# Altium schematic sheet [13] FPGA_PWR.SchDoc: FPGA Power
size 393 x 281 mm; SheetNumber: 13; SheetTotal: 21; PageSetup: Record=PageOptions|CenterHorizontal=True|CenterVertical=True|PrintScale=0.94|XCorrection=0.00|YCorrection=0.00|PrintKind=0|BorderSize=5000000|LeftOffset=0|BottomOffset=0|Orientation=2|PaperLength=1000|PaperWidth=1000|Scale=100|PaperSource=15|PrintQuality=600|MediaType=1|DitherType=10|PrintScaleMode=1|PaperKind=A4; Adr1: August Barks gata 6B; Adr2: SE-421 32 Västra Frölunda; Adr3: Sweden; Webpage: www.omnisys.se
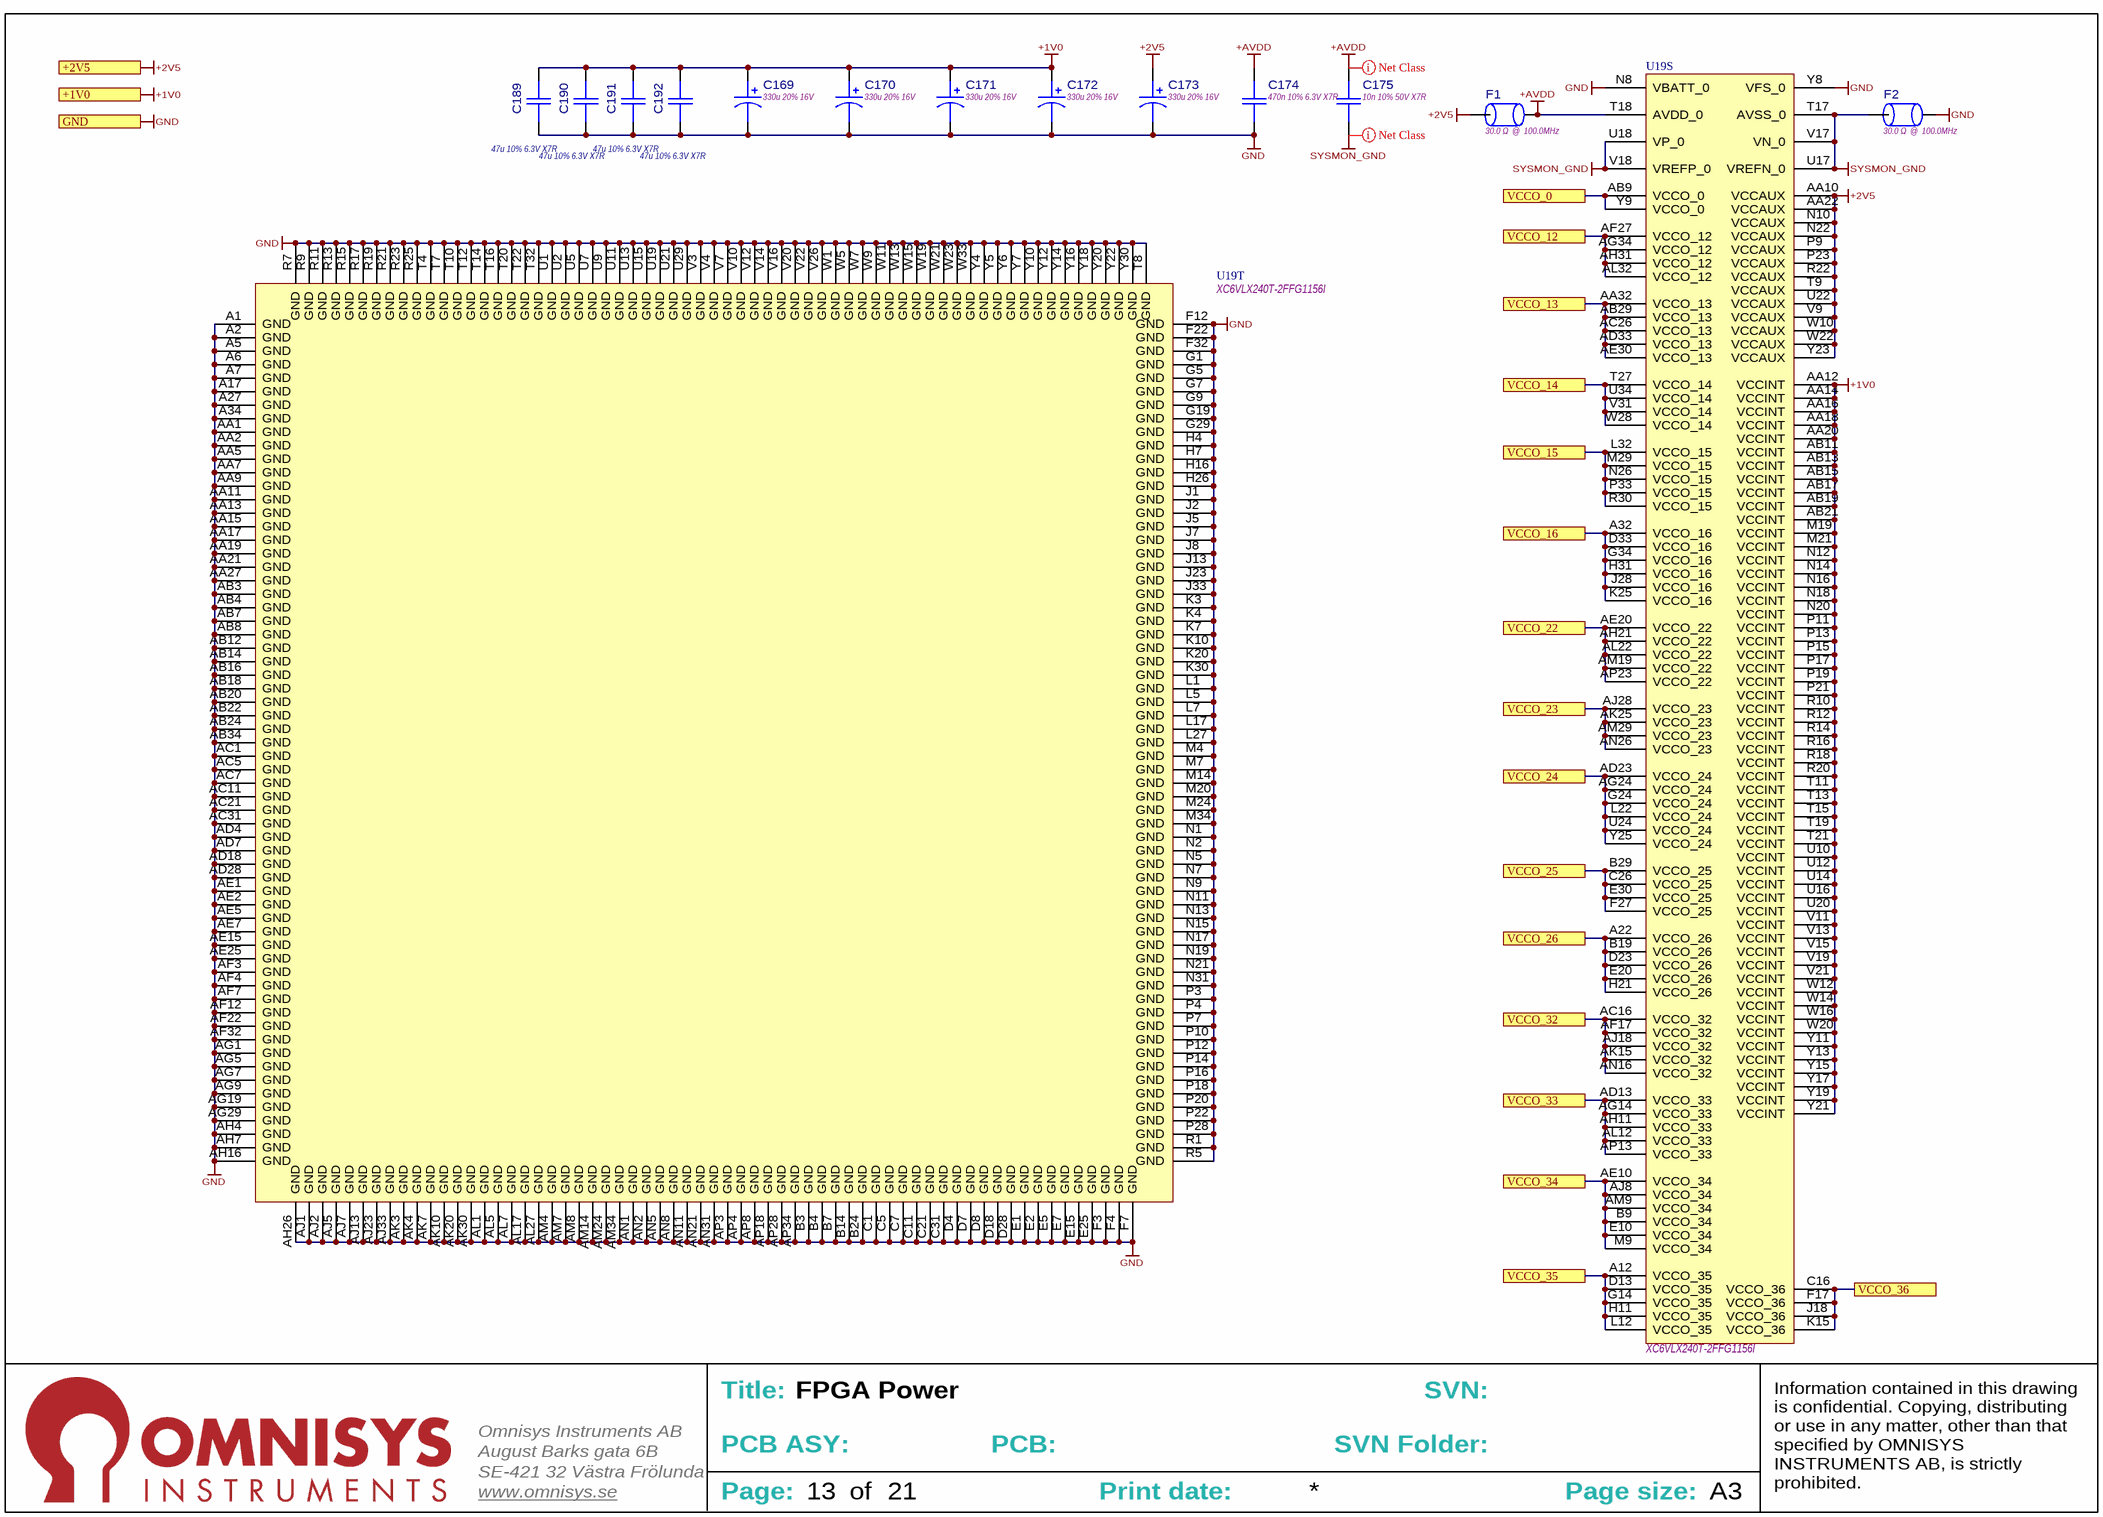
[diagram p0: [13] FPGA_PWR.SchDoc]

## Parts
C169  330u 20% 16V  [CAPMP7343X43N]
C170  330u 20% 16V  [CAPMP7343X43N]
C171  330u 20% 16V  [CAPMP7343X43N]
C172  330u 20% 16V  [CAPMP7343X43N]
C173  330u 20% 16V  [CAPMP7343X43N]
C174  470n 10% 6.3V X7R  [CAPC1608X90N]
C175  10n 10% 50V X7R  [CAPC1608X90N]
C189  47u 10% 6.3V X7R  [CAPC3225X270N]
C190  47u 10% 6.3V X7R  [CAPC3225X270N]
C191  47u 10% 6.3V X7R  [CAPC3225X270N]
C192  47u 10% 6.3V X7R  [CAPC3225X270N]
F1  30.0 Ω  @  100.0MHz  [INDC2012X11L]
F2  30.0 Ω  @  100.0MHz  [INDC2012X11L]
U19  XC6VLX240T-2FFG1156I  [FFG1156]  (parts S,T of 20)

## Ports
+1V0, +2V5, GND, VCCO_0, VCCO_12, VCCO_13, VCCO_14, VCCO_15, VCCO_16, VCCO_22, VCCO_23, VCCO_24, VCCO_25, VCCO_26, VCCO_32, VCCO_33, VCCO_34, VCCO_35, VCCO_36

## Nets
+1V0: C169.1 C170.1 C171.1 C172.1 C189.1 C190.1 C191.1 C192.1 U19.AA12(VCCINT) U19.AA14(VCCINT) U19.AA16(VCCINT) U19.AA18(VCCINT) U19.AA20(VCCINT) U19.AB11(VCCINT) U19.AB13(VCCINT) U19.AB15(VCCINT) U19.AB17(VCCINT) U19.AB19(VCCINT) U19.AB21(VCCINT) U19.M19(VCCINT) U19.M21(VCCINT) U19.N12(VCCINT) U19.N14(VCCINT) U19.N16(VCCINT) U19.N18(VCCINT) U19.N20(VCCINT) U19.P11(VCCINT) U19.P13(VCCINT) U19.P15(VCCINT) U19.P17(VCCINT) U19.P19(VCCINT) U19.P21(VCCINT) U19.R10(VCCINT) U19.R12(VCCINT) U19.R14(VCCINT) U19.R16(VCCINT) U19.R18(VCCINT) U19.R20(VCCINT) U19.T11(VCCINT) U19.T13(VCCINT) U19.T15(VCCINT) U19.T19(VCCINT) U19.T21(VCCINT) U19.U10(VCCINT) U19.U12(VCCINT) U19.U14(VCCINT) U19.U16(VCCINT) U19.U20(VCCINT) U19.V11(VCCINT) U19.V13(VCCINT) U19.V15(VCCINT) U19.V19(VCCINT) U19.V21(VCCINT) U19.W12(VCCINT) U19.W14(VCCINT) U19.W16(VCCINT) U19.W20(VCCINT) U19.Y11(VCCINT) U19.Y13(VCCINT) U19.Y15(VCCINT) U19.Y17(VCCINT) U19.Y19(VCCINT) U19.Y21(VCCINT) ; port +1V0
+2V5: C173.1 F1.1 U19.AA10(VCCAUX) U19.AA22(VCCAUX) U19.N10(VCCAUX) U19.N22(VCCAUX) U19.P9(VCCAUX) U19.P23(VCCAUX) U19.R22(VCCAUX) U19.T9(VCCAUX) U19.U22(VCCAUX) U19.V9(VCCAUX) U19.W10(VCCAUX) U19.W22(VCCAUX) U19.Y23(VCCAUX) ; port +2V5
+AVDD: C174.1 C175.1 F1.2 U19.T18(AVDD_0)
GND: C169.2 C170.2 C171.2 C172.2 C173.2 C174.2 C189.2 C190.2 C191.2 C192.2 F2.2 U19.A1(GND) U19.A2(GND) U19.A5(GND) U19.A6(GND) U19.A7(GND) U19.A17(GND) U19.A27(GND) U19.A34(GND) U19.AA1(GND) U19.AA2(GND) U19.AA5(GND) U19.AA7(GND) U19.AA9(GND) U19.AA11(GND) U19.AA13(GND) U19.AA15(GND) U19.AA17(GND) U19.AA19(GND) U19.AA21(GND) U19.AA27(GND) U19.AB3(GND) U19.AB4(GND) U19.AB7(GND) U19.AB8(GND) U19.AB12(GND) U19.AB14(GND) U19.AB16(GND) U19.AB18(GND) U19.AB20(GND) U19.AB22(GND) U19.AB24(GND) U19.AB34(GND) U19.AC1(GND) U19.AC5(GND) U19.AC7(GND) U19.AC11(GND) U19.AC21(GND) U19.AC31(GND) U19.AD4(GND) U19.AD7(GND) U19.AD18(GND) U19.AD28(GND) U19.AE1(GND) U19.AE2(GND) U19.AE5(GND) U19.AE7(GND) U19.AE15(GND) U19.AE25(GND) U19.AF3(GND) U19.AF4(GND) U19.AF7(GND) U19.AF12(GND) U19.AF22(GND) U19.AF32(GND) U19.AG1(GND) U19.AG5(GND) U19.AG7(GND) U19.AG9(GND) U19.AG19(GND) U19.AG29(GND) U19.AH4(GND) U19.AH7(GND) U19.AH16(GND) U19.AH26(GND) U19.AJ1(GND) U19.AJ2(GND) U19.AJ5(GND) U19.AJ7(GND) U19.AJ13(GND) U19.AJ23(GND) U19.AJ33(GND) U19.AK3(GND) U19.AK4(GND) U19.AK7(GND) U19.AK10(GND) U19.AK20(GND) U19.AK30(GND) U19.AL1(GND) U19.AL5(GND) U19.AL7(GND) U19.AL17(GND) U19.AL27(GND) U19.AM4(GND) U19.AM7(GND) U19.AM8(GND) U19.AM14(GND) U19.AM24(GND) U19.AM34(GND) U19.AN1(GND) U19.AN2(GND) U19.AN5(GND) U19.AN8(GND) U19.AN11(GND) U19.AN21(GND) U19.AN31(GND) U19.AP3(GND) U19.AP4(GND) U19.AP8(GND) U19.AP18(GND) U19.AP28(GND) U19.AP34(GND) U19.B3(GND) U19.B4(GND) U19.B7(GND) U19.B14(GND) U19.B24(GND) U19.C1(GND) U19.C5(GND) U19.C7(GND) U19.C11(GND) U19.C21(GND) U19.C31(GND) U19.D4(GND) U19.D7(GND) U19.D8(GND) U19.D18(GND) U19.D28(GND) U19.E1(GND) U19.E2(GND) U19.E5(GND) U19.E7(GND) U19.E15(GND) U19.E25(GND) U19.F3(GND) U19.F4(GND) U19.F7(GND) U19.F12(GND) U19.F22(GND) U19.F32(GND) U19.G1(GND) U19.G5(GND) U19.G7(GND) U19.G9(GND) U19.G19(GND) U19.G29(GND) U19.H4(GND) U19.H7(GND) U19.H16(GND) U19.H26(GND) U19.J1(GND) U19.J2(GND) U19.J5(GND) U19.J7(GND) U19.J8(GND) U19.J13(GND) U19.J23(GND) U19.J33(GND) U19.K3(GND) U19.K4(GND) U19.K7(GND) U19.K10(GND) U19.K20(GND) U19.K30(GND) U19.L1(GND) U19.L5(GND) U19.L7(GND) U19.L17(GND) U19.L27(GND) U19.M4(GND) U19.M7(GND) U19.M14(GND) U19.M20(GND) U19.M24(GND) U19.M34(GND) U19.N1(GND) U19.N2(GND) U19.N5(GND) U19.N7(GND) U19.N8(VBATT_0) U19.N9(GND) U19.N11(GND) U19.N13(GND) U19.N15(GND) U19.N17(GND) U19.N19(GND) U19.N21(GND) U19.N31(GND) U19.P3(GND) U19.P4(GND) U19.P7(GND) U19.P10(GND) U19.P12(GND) U19.P14(GND) U19.P16(GND) U19.P18(GND) U19.P20(GND) U19.P22(GND) U19.P28(GND) U19.R1(GND) U19.R5(GND) U19.R7(GND) U19.R9(GND) U19.R11(GND) U19.R13(GND) U19.R15(GND) U19.R17(GND) U19.R19(GND) U19.R21(GND) U19.R23(GND) U19.R25(GND) U19.T4(GND) U19.T7(GND) U19.T8(GND) U19.T10(GND) U19.T12(GND) U19.T14(GND) U19.T16(GND) U19.T20(GND) U19.T22(GND) U19.T32(GND) U19.U1(GND) U19.U2(GND) U19.U5(GND) U19.U7(GND) U19.U9(GND) U19.U11(GND) U19.U13(GND) U19.U15(GND) U19.U19(GND) U19.U21(GND) U19.U29(GND) U19.V3(GND) U19.V4(GND) U19.V7(GND) U19.V10(GND) U19.V12(GND) U19.V14(GND) U19.V16(GND) U19.V20(GND) U19.V22(GND) U19.V26(GND) U19.W1(GND) U19.W5(GND) U19.W7(GND) U19.W9(GND) U19.W11(GND) U19.W13(GND) U19.W15(GND) U19.W19(GND) U19.W21(GND) U19.W23(GND) U19.W33(GND) U19.Y4(GND) U19.Y5(GND) U19.Y6(GND) U19.Y7(GND) U19.Y8(VFS_0) U19.Y10(GND) U19.Y12(GND) U19.Y14(GND) U19.Y16(GND) U19.Y18(GND) U19.Y20(GND) U19.Y22(GND) U19.Y30(GND) ; port GND
SYSMON_GND: C175.2 F2.1 U19.T17(AVSS_0) U19.U17(VREFN_0) U19.U18(VP_0) U19.V17(VN_0) U19.V18(VREFP_0)
VCCO_0: U19.AB9(VCCO_0) U19.Y9(VCCO_0) ; port VCCO_0
VCCO_12: U19.AF27(VCCO_12) U19.AG34(VCCO_12) U19.AH31(VCCO_12) U19.AL32(VCCO_12) ; port VCCO_12
VCCO_13: U19.AA32(VCCO_13) U19.AB29(VCCO_13) U19.AC26(VCCO_13) U19.AD33(VCCO_13) U19.AE30(VCCO_13) ; port VCCO_13
VCCO_14: U19.T27(VCCO_14) U19.U34(VCCO_14) U19.V31(VCCO_14) U19.W28(VCCO_14) ; port VCCO_14
VCCO_15: U19.L32(VCCO_15) U19.M29(VCCO_15) U19.N26(VCCO_15) U19.P33(VCCO_15) U19.R30(VCCO_15) ; port VCCO_15
VCCO_16: U19.A32(VCCO_16) U19.D33(VCCO_16) U19.G34(VCCO_16) U19.H31(VCCO_16) U19.J28(VCCO_16) U19.K25(VCCO_16) ; port VCCO_16
VCCO_22: U19.AE20(VCCO_22) U19.AH21(VCCO_22) U19.AL22(VCCO_22) U19.AM19(VCCO_22) U19.AP23(VCCO_22) ; port VCCO_22
VCCO_23: U19.AJ28(VCCO_23) U19.AK25(VCCO_23) U19.AM29(VCCO_23) U19.AN26(VCCO_23) ; port VCCO_23
VCCO_24: U19.AD23(VCCO_24) U19.AG24(VCCO_24) U19.G24(VCCO_24) U19.L22(VCCO_24) U19.U24(VCCO_24) U19.Y25(VCCO_24) ; port VCCO_24
VCCO_25: U19.B29(VCCO_25) U19.C26(VCCO_25) U19.E30(VCCO_25) U19.F27(VCCO_25) ; port VCCO_25
VCCO_26: U19.A22(VCCO_26) U19.B19(VCCO_26) U19.D23(VCCO_26) U19.E20(VCCO_26) U19.H21(VCCO_26) ; port VCCO_26
VCCO_32: U19.AC16(VCCO_32) U19.AF17(VCCO_32) U19.AJ18(VCCO_32) U19.AK15(VCCO_32) U19.AN16(VCCO_32) ; port VCCO_32
VCCO_33: U19.AD13(VCCO_33) U19.AG14(VCCO_33) U19.AH11(VCCO_33) U19.AL12(VCCO_33) U19.AP13(VCCO_33) ; port VCCO_33
VCCO_34: U19.AE10(VCCO_34) U19.AJ8(VCCO_34) U19.AM9(VCCO_34) U19.B9(VCCO_34) U19.E10(VCCO_34) U19.M9(VCCO_34) ; port VCCO_34
VCCO_35: U19.A12(VCCO_35) U19.D13(VCCO_35) U19.G14(VCCO_35) U19.H11(VCCO_35) U19.L12(VCCO_35) ; port VCCO_35
VCCO_36: U19.C16(VCCO_36) U19.F17(VCCO_36) U19.J18(VCCO_36) U19.K15(VCCO_36) ; port VCCO_36

## Layout directives
net class Power: +AVDD, SYSMON_GND

## Notes on the sheet
- Title:
- SVN:
- August Barks gata 6B
- SE-421 32 Västra Frölunda
- Omnisys Instruments AB
- PCB ASY:
- PCB:
- SVN Folder:
- www.omnisys.se
- Page:
- of
- Print date:
- Page size:
- A3
- Information contained in this drawing is confidential. Copying, distributing or use in any matter, other than that specified by OMNISYS INSTRUMENTS AB, is strictly prohibited.

## Library data of the parts
C169-C173 = CMP-0300-000208-8: Standard tantalum capacitor, 7343/Case E; ESR: 0.4; Capacitance: 330µF; DCL: 52.8A; DF: 30%; Tolerance: 20%; Rated Voltage: 16V; Case/Package: 7343
C174 = CMP-0300-002107-6: Ceramic Chip Capacitor, 0603/1608; Capacitance: 470nF; Package: 1608/0603; Temperature Charateristics: X7R; Tolerance: 10%; Rated Voltage: 6.3V; Thickness: 900µm; Weight: 9mg
C175 = CMP-0300-002475-6: Ceramic Chip Capacitor, 0603/1608; Temperature Charateristics: C0G; Tolerance: 5%; Capacitance: 10nF; Package: 1608/0603; Rated Voltage: 50V; Thickness: 900µm; Weight: 9mg
C189-C192 = CMP-0300-002062-5: Ceramic Chip Capacitor, 1210/3225; Capacitance: 47µF; Temperature Charateristics: X7R; Tolerance: 10%; Thickness: 2.7mm; Case/Package: 1210/3225; Rated Voltage: 6.3V
F1 F2 = CMP-0600-000010-2: Ferrite bead, Würth Elektronik WE-CBF 2012 (0805), 74279206 ,  30.0 Ω  @  100.0MHz; Zmax@Freq: 55.0 Ω  @      1.0 GHz; Type: High Current; RDC: 25.0 mΩ; IDC: 3.0 A; Z@Freq: 30.0 Ω  @  100.0MHz; PartNumber: 74279206
U19 = CMP-2100-000586-1: FPGA Virtex-6 LXT Family 241152 Cells 40nm (CMOS) Technology 1V 1156-Pin FCBGA; Number of I/Os: 600; Number of Logic Blocks (LABs): 18840; Number of Logic Elements/Cells: 241152; RAM Size: 15335424b; Speed Grade: 2; Case/Package: FCBGA; Max Operating Temperature: 100°C; Min Operating Temperature: -40°C; Mount: Surface Mount; Number of Pins: 1156; Operating Supply Voltage: 1V; Package Quantity: 1